# Altium schematic sheet COVER.SchDoc: My title
size A3; Organization: University of California; Address1: 475 Portola Plaza; Address2: Los Angeles, CA 90095; Revision: R01; SheetNumber: 1; SheetTotal: 1
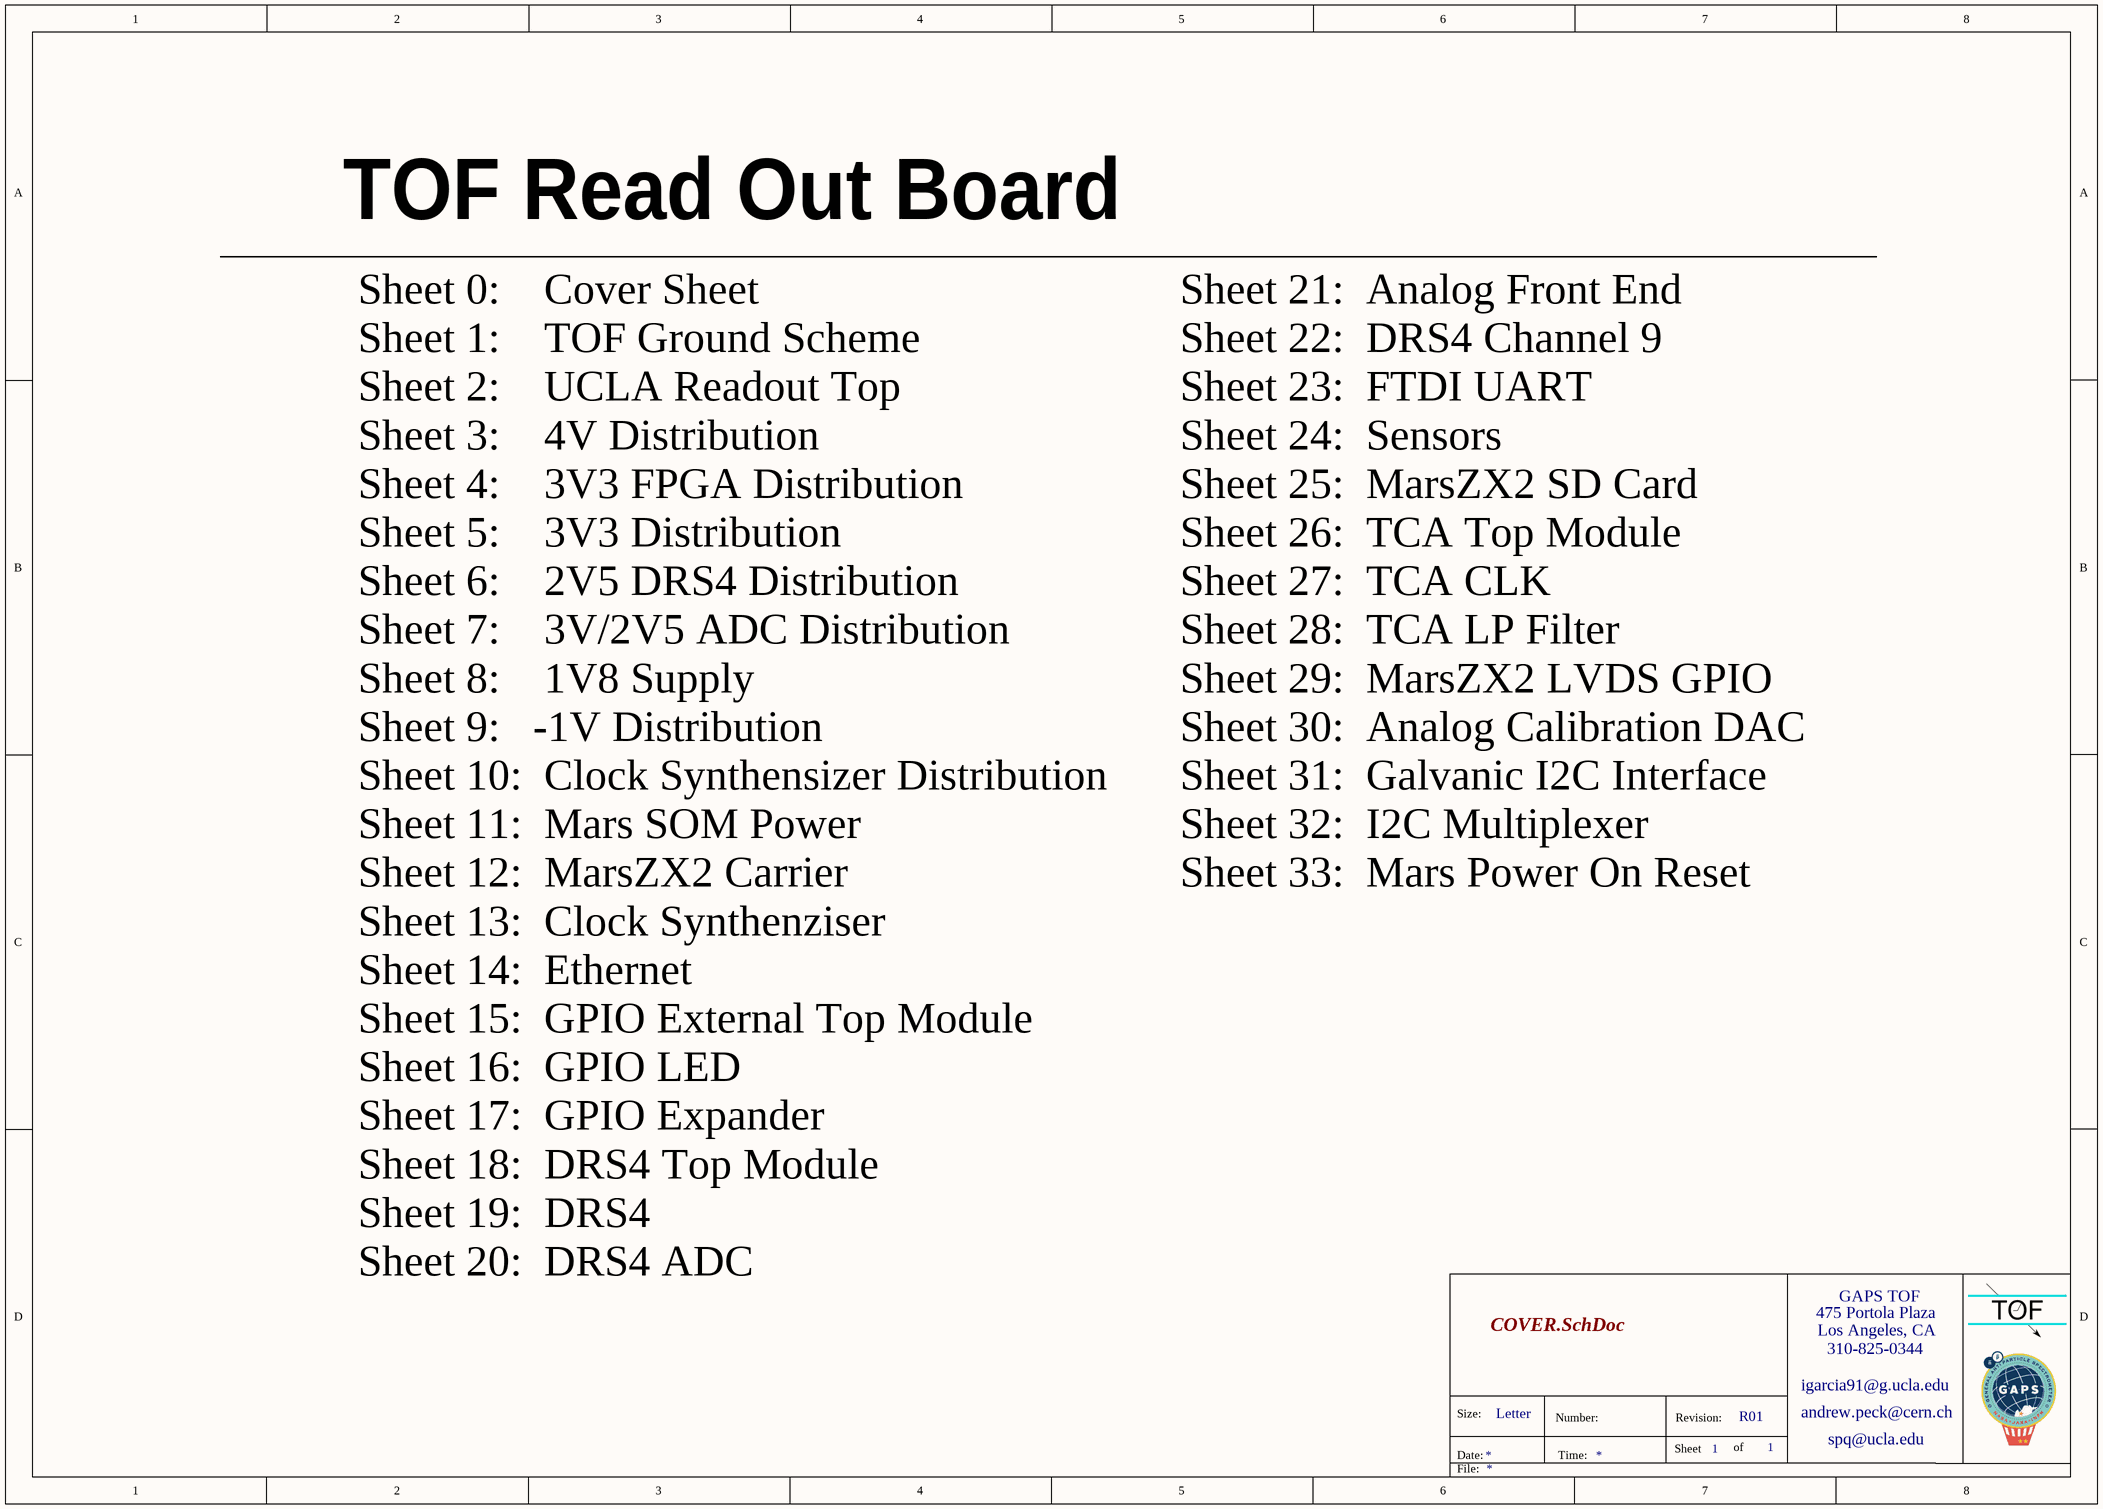
[diagram p0: COVER.SchDoc]

## Notes on the sheet
- TOF Read Out Board
- Sheet 21:  Analog Front End
  Sheet 22:  DRS4 Channel 9
  Sheet 23:  FTDI UART
  Sheet 24:  Sensors
  Sheet 25:  MarsZX2 SD Card
  Sheet 26:  TCA Top Module
  Sheet 27:  TCA CLK
  Sheet 28:  TCA LP Filter
  Sheet 29:  MarsZX2 LVDS GPIO
  Sheet 30:  Analog Calibration DAC
  Sheet 31:  Galvanic I2C Interface
  Sheet 32:  I2C Multiplexer
  Sheet 33:  Mars Power On Reset
- Sheet 0:    Cover Sheet
  Sheet 1:    TOF Ground Scheme
  Sheet 2:    UCLA Readout Top
  Sheet 3:    4V Distribution
  Sheet 4:    3V3 FPGA Distribution
  Sheet 5:    3V3 Distribution
  Sheet 6:    2V5 DRS4 Distribution
  Sheet 7:    3V/2V5 ADC Distribution
  Sheet 8:    1V8 Supply
  Sheet 9:   -1V Distribution
  Sheet 10:  Clock Synthensizer Distribution
  Sheet 11:  Mars SOM Power
  Sheet 12:  MarsZX2 Carrier
  Sheet 13:  Clock Synthenziser
  Sheet 14:  Ethernet
  Sheet 15:  GPIO External Top Module
  Sheet 16:  GPIO LED
  Sheet 17:  GPIO Expander
  Sheet 18:  DRS4 Top Module
  Sheet 19:  DRS4
  Sheet 20:  DRS4 ADC
- 475 Portola Plaza
- GAPS TOF
- igarcia91@g.ucla.edu
- Los Angeles, CA
- 310-825-0344
- Size:
- Date:
- Letter
- Number:
- Time:
- Sheet
- Revision:
- of
- andrew.peck@cern.ch
- spq@ucla.edu
- File: